# Altium schematic sheet TCA_CLK_DIST.SchDoc: My title
size A3; Organization: University of California; Address1: 475 Portola Plaza; Address2: Los Angeles, CA 90095; DocumentNumber: 26; Revision: R01; SheetNumber: 26; SheetTotal: 35
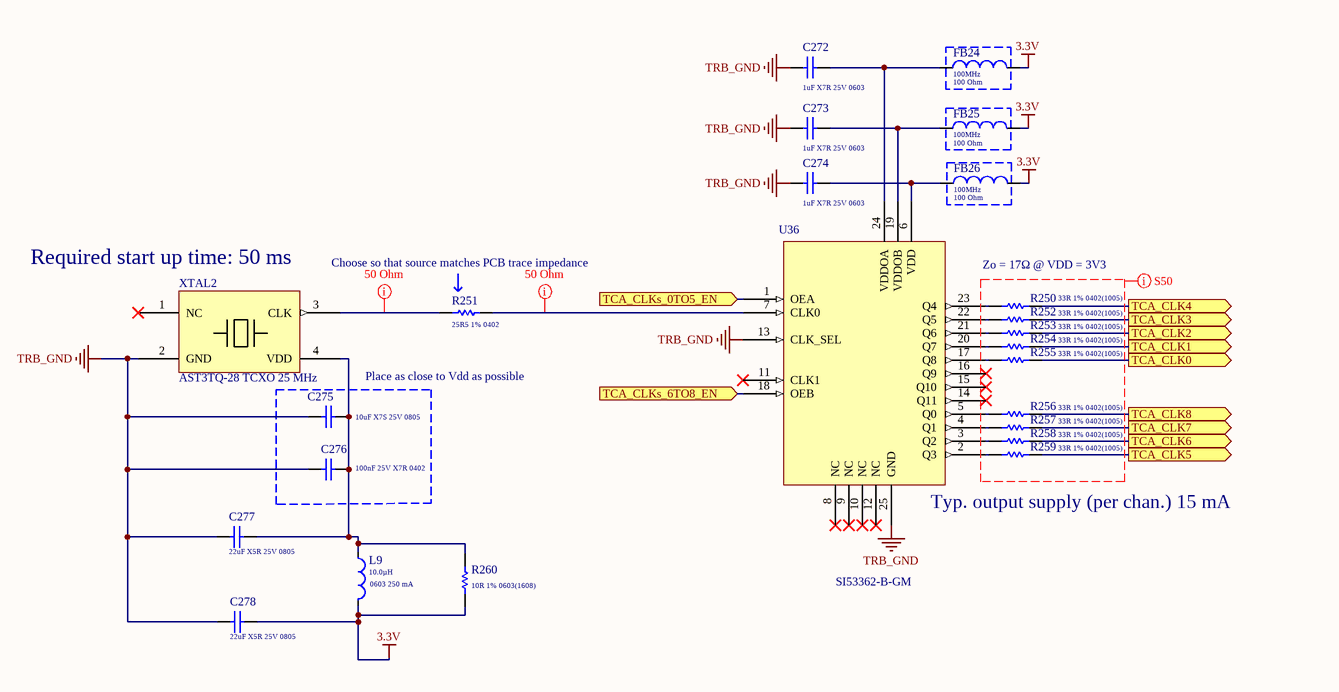
[diagram p0: TCA_CLK_DIST.SchDoc]

## Parts
C272  Capacitance: 1uF X7R 25V 0603  [Cap_Murata_GCJ188R71E105KA01J_1uF]  (hidden comment: Cap_Murata_GCJ188R71E105KA01J_1uF)
C273  Capacitance: 1uF X7R 25V 0603  [Cap_Murata_GCJ188R71E105KA01J_1uF]  (hidden comment: Cap_Murata_GCJ188R71E105KA01J_1uF)
C274  Capacitance: 1uF X7R 25V 0603  [Cap_Murata_GCJ188R71E105KA01J_1uF]  (hidden comment: Cap_Murata_GCJ188R71E105KA01J_1uF)
C275  Capacitance: 10uF X7S 25V 0805  [Cap_Murata_ GRM21BC71E106ME11L_10uF]  (hidden comment: Cap_Murata_ GRM21BC71E106ME11L_10uF)
C276  Capacitance: 100nF 25V X7R 0402  [Cap_Taiyo_Yuden_TMK105B7104KV-FR_100nF]  (hidden comment: Cap_Taiyo_Yuden_TMK105B7104KV-FR_100nF)
C277  Capacitance: 22uF X5R 25V 0805  [Cap_Murata_GRT21BR61E226ME13L_22uF]  (hidden comment: Cap_Murata_GRT21BR61E226ME13L_22uF)
C278  Capacitance: 22uF X5R 25V 0805  [Cap_Murata_GRT21BR61E226ME13L_22uF]  (hidden comment: Cap_Murata_GRT21BR61E226ME13L_22uF)
FB24  Measuring Frequency: 100MHz  Impedance: 100 Ohm  [FB_Wurth_Electronics_742792731_100Ohms]  (hidden comment: 742792731)
FB25  Measuring Frequency: 100MHz  Impedance: 100 Ohm  [FB_Wurth_Electronics_742792731_100Ohms]  (hidden comment: 742792731)
FB26  Measuring Frequency: 100MHz  Impedance: 100 Ohm  [FB_Wurth_Electronics_742792731_100Ohms]  (hidden comment: 742792731)
L9  0603 250 mA  Inductance: 10.0µH  [TDK_MLZ1608M100WT_0]
R250  33R 1% 0402(1005)  [RESC0402(1005)_L]
R251  25R5 1% 0402  [RESC0402(1005)_L]
R252  33R 1% 0402(1005)  [RESC0402(1005)_L]
R253  33R 1% 0402(1005)  [RESC0402(1005)_L]
R254  33R 1% 0402(1005)  [RESC0402(1005)_L]
R255  33R 1% 0402(1005)  [RESC0402(1005)_L]
R256  33R 1% 0402(1005)  [RESC0402(1005)_L]
R257  33R 1% 0402(1005)  [RESC0402(1005)_L]
R258  33R 1% 0402(1005)  [RESC0402(1005)_L]
R259  33R 1% 0402(1005)  [RESC0402(1005)_L]
R260  10R 1% 0603(1608)  [RESC0603(1608)_L]
U36  SI53362-B-GM  [Si53362]
XTAL2  AST3TQ-28 TCXO 25 MHz  [XTAL_ASDM1-25.000MHZ-LC-T]

## Blocks framed on the sheet
Place as close to Vdd as possible: C275 C276

## Ports
TCA_CLK0 (out), TCA_CLK1 (out), TCA_CLK2 (out), TCA_CLK3 (out), TCA_CLK4 (out), TCA_CLK5 (out), TCA_CLK6 (out), TCA_CLK7 (out), TCA_CLK8 (out), TCA_CLKs_0TO5_EN (in), TCA_CLKs_6TO8_EN (in)

## Nets
3.3V: C278.2 FB24.2 FB25.2 FB26.2 L9.2 R260.1
TRB_GND: C272.2 C273.2 C274.2 C275.1 C276.2 C277.1 C278.1 U36.13(CLK_SEL) U36.25(GND) XTAL2.2(GND)
TCA_CLK0: R255.2 ; port TCA_CLK0
TCA_CLK1: R254.2 ; port TCA_CLK1
TCA_CLK2: R253.2 ; port TCA_CLK2
TCA_CLK3: R252.2 ; port TCA_CLK3
TCA_CLK4: R250.2 ; port TCA_CLK4
TCA_CLK5: R259.2 ; port TCA_CLK5
TCA_CLK6: R258.2 ; port TCA_CLK6
TCA_CLK7: R257.2 ; port TCA_CLK7
TCA_CLK8: R256.2 ; port TCA_CLK8
TCA_CLKs_0TO5_EN: U36.1(OEA) ; port TCA_CLKs_0TO5_EN
TCA_CLKs_6TO8_EN: U36.18(OEB) ; port TCA_CLKs_6TO8_EN
NetC272_1: C272.1 FB24.1 U36.24(VDDOA)
NetC273_1: C273.1 FB25.1 U36.19(VDDOB)
NetC274_1: C274.1 FB26.1 U36.6(VDD)
NetC275_2: C275.2 C276.1 C277.2 L9.1 R260.2 XTAL2.4(VDD)
NetR250_1: R250.1 U36.23(Q4)
NetR251_1: R251.1 XTAL2.3(CLK)
NetR251_2: R251.2 U36.7(CLK0)
NetR252_1: R252.1 U36.22(Q5)
NetR253_1: R253.1 U36.21(Q6)
NetR254_1: R254.1 U36.20(Q7)
NetR255_1: R255.1 U36.17(Q8)
NetR256_1: R256.1 U36.5(Q0)
NetR257_1: R257.1 U36.4(Q1)
NetR258_1: R258.1 U36.3(Q2)
NetR259_1: R259.1 U36.2(Q3)

Not connected (* = marked no-connect by the designer): U36 8(NC)* 9(NC)* 10(NC)* 11(CLK1)* 12(NC)* 14(Q11)* 15(Q10)* 16(Q9)*; XTAL2 1(NC)*

## Layout directives
net class S50: (no net found under the mark)

## Notes on the sheet
- (near XTAL2) Required start up time: 50 ms
- Choose so that source matches PCB trace impedance
- Zo = 17Ω @ VDD = 3V3
- (near U36) Typ. output supply (per chan.) 15 mA
- 475 Portola Plaza
- GAPS TOF
- igarcia91@g.ucla.edu
- Los Angeles, CA
- 310-825-0344
- Size:
- Date:
- Letter
- Revision:
- Time:
- Sheet
- of
- andrew.peck@cern.ch
- spq@ucla.edu
- File:

## Library data of the parts
C272-C274 = Cap_Murata_GCJ188R71E105KA01J_1uF: CAP CER 1uF 25V X7R 0603; Supplier 1: Mouser; Supplier Part Number 1: 81-GCJ188R71E105KA1J
C275 = Cap_Murata_ GRM21BC71E106ME11L_10uF: CAP CER 10uF 25V X7R 0805; Supplier 1: Mouser; Supplier Part Number 1: 81-GRM21BC71E106ME1L
C276 = Cap_Taiyo_Yuden_TMK105B7104KV-FR_100nF: CAP CER 100nF 25V X7R 0402; Supplier 1: Mouser; Supplier Part Number 1: 963-TMK105B7104KV-FR
C277 C278 = Cap_Murata_GRT21BR61E226ME13L_22uF: CAP CER 22uF 25V X5R 0805; Supplier 1: Mouser; Supplier Part Number 1: 81-GRT21BR61E226ME3L
FB24-FB26 = FB_Wurth_Electronics_742792731_100Ohms: FB SMD 100 OHM 25% 1.2A 0402; DC Resistance: 90mOhm; Supplier 1: Mouser; Supplier Part Number 1: 710-742792731
L9 = Ind_TDK_MLZ1608M100WT_eec: IND 10µH Shielded Multilayer Inductor 250mA 1.365 Ohm Max 0603 (1608 Metric); Manufacturer: TDK; Value: 10.0µH; Tolerance: ±20%; Part Number: MLZ1608M100WT; helpURL: https://upverter.com/upn/revision/22fa022ced0eb0ec/; ComponentLink2Description: Datasheet; Temperature: -55°C to +125°C; Package: 0603 (1608 metric); Supplier 2: Mouser; Supplier 1: Digi-Key; ComponentLink1URL: https://upverter.com/upn/revision/22fa022ced0eb0ec/; Supplier Part Number 2: 810-MLZ1608M100WT000; Supplier Part Number 1: 445-6389-1-ND; ComponentLink1Description: Upverter; ComponentLink2URL: https://product.tdk.com/info/en/catalog/datasheets/inductor_commercial_decoupling_mlz1608_en.pdf; RoHS: TRUE; Mouser Part Number: 810-MLZ1608M100WT000; Current Rating: 250mA; Ipc Land Pattern Name: CAPC16080X45; Temperature Range High: +125°C; Digikey Description: IND 10µH Shielded Multilayer Inductor 250mA 1.365 Ohm Max 0603 (1608 Metric); Digikey Part Number: 445-6389-1-ND; Lead Free: yes; Temperature Range Low: -55°C; DC Resistance (DCR): 1.365 Ohm Max
R250 R252-R259 = CMP-1011-00341-1: 33R 0.063W 1% 0402 (1005 Metric)  SMD; Case-Metric: 1005; Value: 33.00 Ohm; Case-EIA: 0402; Tolerance: 1 %; Power: 0.063 W; Technology: SMT
R251 = CMP-1011-00328-1: 25R5 0.063W 1% 0402 (1005 Metric)  SMD; Case-EIA: 0402; Case-Metric: 1005; Value: 25.50 Ohm; Tolerance: 1 %; Power: 0.063 W; Technology: SMT
R260 = CMP-1012-00284-1: 10R 0.1W 1% 0603 (1608 Metric)  SMD; Case-Metric: 1608; Case-EIA: 0603; Value: 10.00 Ohm; Tolerance: 1 %; Power: 0.1 W; Technology: SMT
U36 = SI53362-B-GM: Clock Buffer LVCMOS 2:12 buffer (200MHz), 2:1 LVCMOS input max, output enable (QFN24); Supplier 1: Mouser; Supplier Part Number 1: 634-SI53362-B-GM
XTAL2 = AST3TQ-28: TCXO Oscillators 25MHz 3.3Volt LVCMOS 0.280 ppm -40C 85C; Manufacturer 1: Abracon LLC; Manufacturer Part Number 1: AST3TQ-T-25.000MHZ-28; Supplier 1: Digikey; Supplier Part Number 1: 535-12700-ND